# EAGLE schematic nodemcu board (EAGLE 9.3.2)
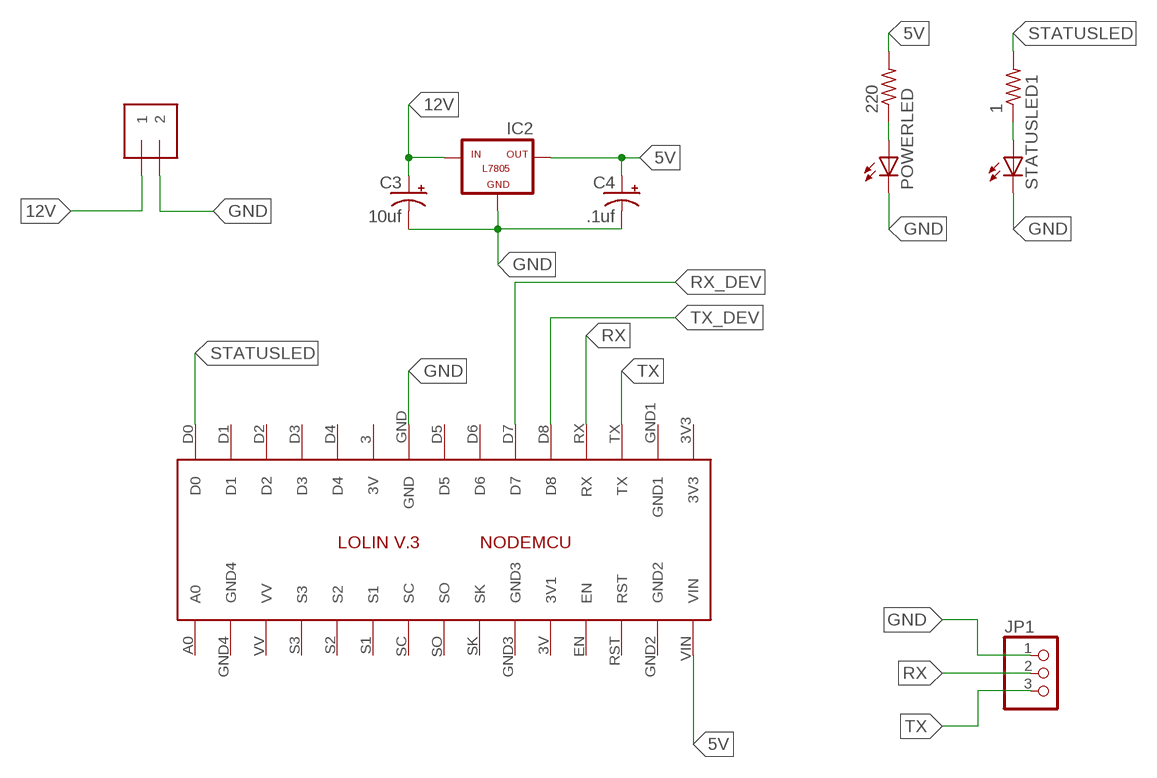
[diagram p0: schematic, sheet 1]

## Parts
1  R-US_0204/5  [0204/5]
220  R-US_0204/5  [0204/5]
C3  10uf  CPOL-USE5-5  [E5-5]
C4  .1uf  CPOL-USE5-5  [E5-5]
IC1  NODEMCU_LOLINV3  [NODEMCU_LOLINV3]
IC2  L7805  [78XXL]
J1  1X2-3.5MM  [1X2-3.5MM]
JP1  PINHD-1X3  [1X03]
POWERLED  LED5MM  [LED5MM]
STATUSLED1  LED5MM  [LED5MM]

## Nets
5V: 220.2 C4.+ IC1.VIN IC2.OUT
12V: C3.+ IC2.IN J1.1
GND: C3.- C4.- IC1.GND IC2.GND J1.2 JP1.1 POWERLED.K(C) STATUSLED1.K(C)
N$1: 220.1 POWERLED.A
N$2: 1.1 STATUSLED1.A
RX: IC1.RX JP1.2
RX_DEV: IC1.D7
STATUSLED: 1.2 IC1.D0
TX: IC1.TX JP1.3
TX_DEV: IC1.D8
Unconnected: IC1.3(3V) IC1.3V3 IC1.3V(3V1) IC1.A0 IC1.D1 IC1.D2 IC1.D3 IC1.D4 IC1.D5 IC1.D6 IC1.EN IC1.GND1 IC1.GND2 IC1.GND3 IC1.GND4 IC1.RST IC1.S1 IC1.S2 IC1.S3 IC1.SC IC1.SK IC1.SO IC1.VV

## Library data of the parts
1 220 = adafruit:R-US_: RESISTOR, American symbol
C3 C4 = adafruit:CPOL-US: POLARIZED CAPACITOR, American symbol
IC1 = Lolin:NODEMCU_LOLINV3
IC2 = tango:L7805: VOLTAGE REGULATOR
J1 = adafruit:1X2: 3.5mm Terminal block http://www.ladyada.net/library/pcb/eaglelibrary.html
JP1 = adafruit:PINHD-1X3: PIN HEADER
POWERLED STATUSLED1 = adafruit:LED: LED OSRAM: - CHIPLED LG R971, LG N971, LY N971, LG Q971, LY Q971, LO R971, LY R971 LH N974, LH R974 LS Q976, LO Q976, LY Q976 LO Q996 - Hyper CHIPLED LW Q18S LB Q993, LB Q99A, LB R99A - SideLED LS A670, LO A670, LY A670, LG A670, LP A670 LB A673, LV A673, LT A673, LW A673 LH A674 LY A675 LS A676, LA A676, LO A676, LY A676, LW A676 LS A679, LY A679, LG A679 - Hyper Micro SIDELED® LS Y876, LA Y876, LO Y876, LY Y876 LT Y87S - SmartLED LW L88C, LW L88S LB L89C, LB L89S, LG L890 LS L89K, LO L89K, LY L89K LS L896, LA L896, LO L896, LY L896 - TOPLED LS T670, LO T670, LY T670, LG T670, LP T670 LSG T670, LSP T670, LSY T670, LOP T670, LYG T670 LG T671, LOG T671, LSG T671 LB T673, LV T673, LT T673, LW T673 LH T674 LS T676, LA T676, LO T676, LY T676, LB T676, LH T676, LSB T676, LW T676 LB T67C, LV T67C, LT T67C, LS T67K, LO T67K, LY T67K, LW E67C LS E67B, LA E67B, LO E67B, LY E67B, LB E67C, LV E67C, LT E67C LW T67C LS T679, LY T679, LG T679 LS T770, LO T770, LY T770, LG T770, LP T770 LB T773, LV T773, LT T773, LW T773 LH T774 LS E675, LA E675, LY E675, LS T675 LS T776, LA T776, LO T776, LY T776, LB T776 LHGB T686 LT T68C, LB T68C - Hyper Mini TOPLED® LB M676 - Mini TOPLED Santana® LG M470 LS M47K, LO M47K, LY M47K Source: http://www.osram.convergy.de/